# Altium schematic sheet transc_MRF24J40MA.SchDoc
size A; PageSetup: Record=PageOptions|CenterHorizontal=True|CenterVertical=True|PrintScale=1.00|XCorrection=1.00|YCorrection=1.00|PrintKind=1|BorderSize=5000000|LeftOffset=0|BottomOffset=0|Orientation=2|PaperLength=1000|PaperWidth=1000|Scale=100|PaperSource=7|PrintQuality=-4|MediaType=1|DitherType=10|PaperKind=A4|PrintScaleMode=1
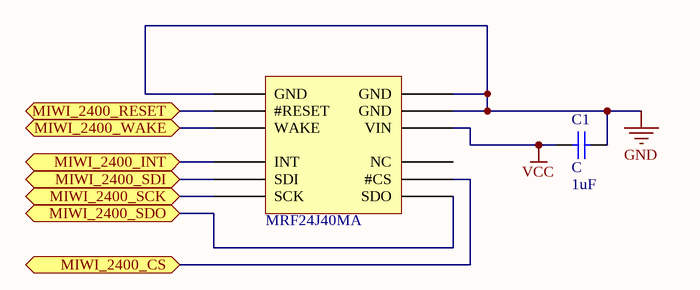
[diagram p0: transc_MRF24J40MA.SchDoc]

## Parts
C1  C  value 1uF  [RAD-0.3]
MRF24J40MA  MRF24J40MA  [MRF24J40MA]  (value not drawn)

## Ports
MIWI_2400_CS, MIWI_2400_INT, MIWI_2400_RESET, MIWI_2400_SCK, MIWI_2400_SDI, MIWI_2400_SDO, MIWI_2400_WAKE

## Nets
GND: C1.2 MRF24J40MA.1(GND) MRF24J40MA.7(GND) MRF24J40MA.8(GND)
VCC: C1.1 MRF24J40MA.9(VIN)
MIWI_2400_CS: MRF24J40MA.11(#CS) ; port MIWI_2400_CS
MIWI_2400_INT: MRF24J40MA.4(INT) ; port MIWI_2400_INT
MIWI_2400_RESET: MRF24J40MA.2(#RESET) ; port MIWI_2400_RESET
MIWI_2400_SCK: MRF24J40MA.6(SCK) ; port MIWI_2400_SCK
MIWI_2400_SDI: MRF24J40MA.5(SDI) ; port MIWI_2400_SDI
MIWI_2400_SDO: MRF24J40MA.12(SDO) ; port MIWI_2400_SDO
MIWI_2400_WAKE: MRF24J40MA.3(WAKE) ; port MIWI_2400_WAKE

Not connected (* = marked no-connect by the designer): MRF24J40MA 10(NC)

## Library data of the parts
C1 = Cap: Capacitor; Published: 8-Jun-2000; LatestRevisionDate: 17-Jul-2002; LatestRevisionNote: Re-released for DXP Platform.; PackageReference: RAD-0.3; Publisher: Altium Limited; PackageDescription: Radial Cap, Thru-Hole; 2 Leads; 0.3 in Pin Spacing
MRF24J40MA = MRF24J40MA: Microchip RF radio; buy: farnell:1630202